# EAGLE design iCEBlaster (EAGLE 9.6.2)
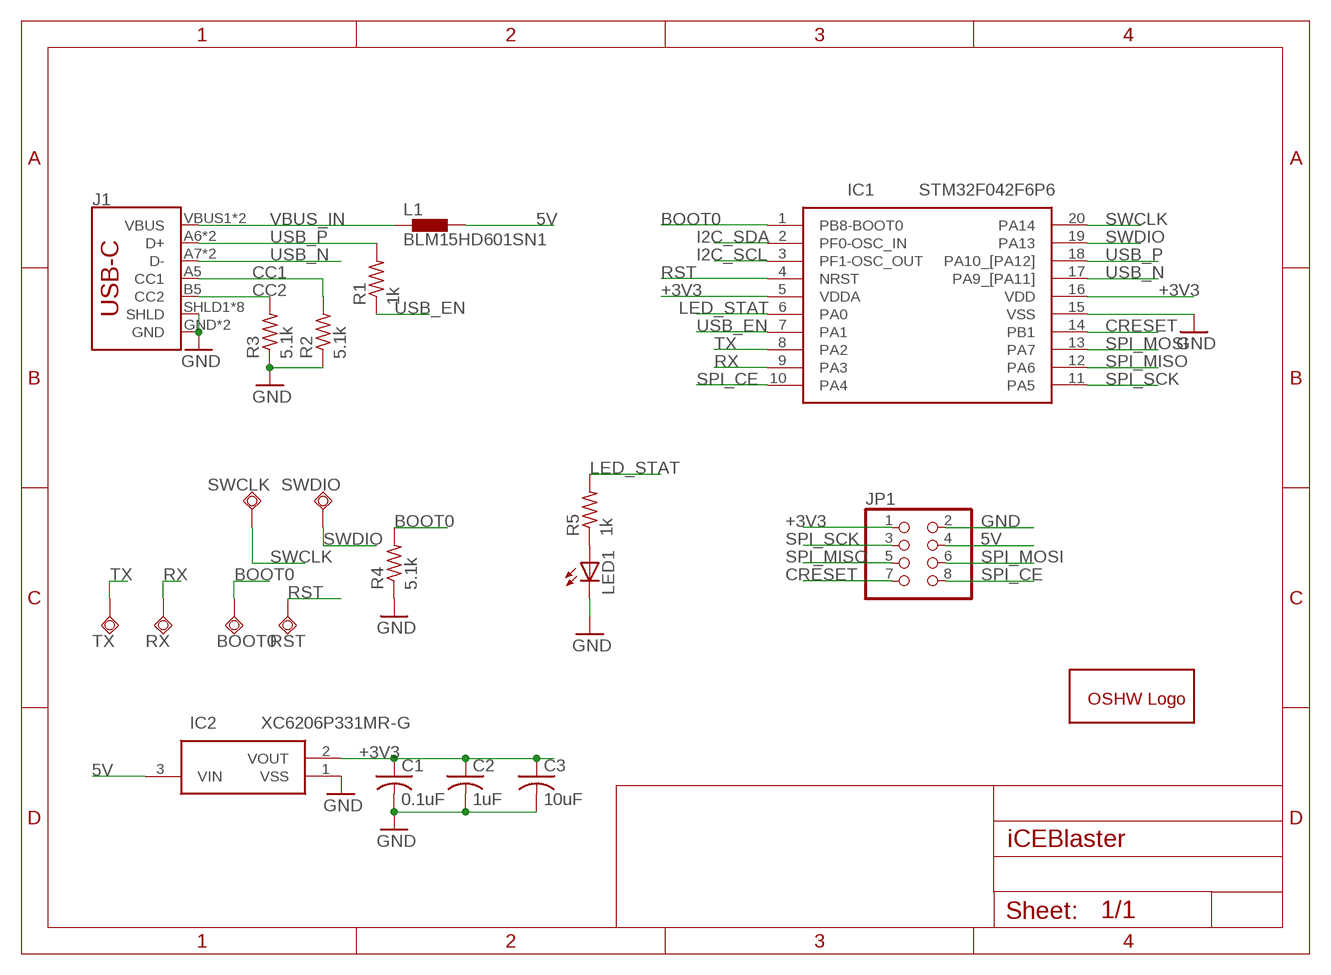
[diagram p0: schematic, sheet 1]

## Parts
BOOT0  TPSQTP15SQ  [TP15SQ]
C1  0.1uF  C-USC0603  [C0603]
C2  1uF  C-USC0603  [C0603]
C3  10uF  C-USC0603  [C0603]
GOLD_ORB_SM1  OSHWLOGOLOGO5MM  [OSHW_5MM]
IC1  STM32F042F6P6  [SOP65P640X120-20N]
IC2  XC6206P331MR-G  [SOT95P280X130-3N]
J1  SPARKFUN-CONNECTORS_USB_C16PIN  [SPARKFUN-CONNECTORS_USB-C-16P]
JP1  PINHD-2X4/90  [2X04/90]
L1  BLM15HD601SN1  [0402]
LED1  LEDCHIP-LED0603  [CHIP-LED0603]
R1  1k  R-US_R0603  [R0603]
R2  5.1k  R-US_R0603  [R0603]
R3  5.1k  R-US_R0603  [R0603]
R4  5.1k  R-US_R0603  [R0603]
R5  1k  R-US_R0603  [R0603]
RST  TPSQTP15SQ  [TP15SQ]
RX  TPSQTP15SQ  [TP15SQ]
SWCLK  TPSQTP15SQ  [TP15SQ]
SWDIO  TPSQTP15SQ  [TP15SQ]
TX  TPSQTP15SQ  [TP15SQ]

## Nets
5V: IC2.3(VIN) JP1.4 L1.2
+3V3: C1.1 C2.1 C3.1 IC1.5(VDDA) IC1.16(VDD) IC2.2(VOUT) JP1.1
BOOT0: BOOT0.TP IC1.1(PB8-BOOT0) R4.2
CC1: J1.A5(CC1) R2.2
CC2: J1.B5(CC2) R3.2
CRESET: IC1.14(PB1) JP1.7
GND: C1.2 C2.2 C3.2 IC1.15(VSS) IC2.1(VSS) J1.GND J1.GND2(GND) J1.SHLD1(SHLD) J1.SHLD2(SHLD) J1.SHLD3(SHLD) J1.SHLD4(SHLD) J1.SHLD5(SHLD) J1.SHLD6(SHLD) J1.SHLD7(SHLD) J1.SHLD8(SHLD) JP1.2 LED1.C R2.1 R3.1 R4.1
I2C_SCL: IC1.3(PF1-OSC_OUT)
I2C_SDA: IC1.2(PF0-OSC_IN)
LED_STAT: IC1.6(PA0) R5.2
N$1: LED1.A R5.1
RST: IC1.4(NRST) RST.TP
RX: IC1.9(PA3) RX.TP
SPI_CE: IC1.10(PA4) JP1.8
SPI_MISO: IC1.12(PA6) JP1.5
SPI_MOSI: IC1.13(PA7) JP1.6
SPI_SCK: IC1.11(PA5) JP1.3
SWCLK: IC1.20(PA14) SWCLK.TP
SWDIO: IC1.19(PA13) SWDIO.TP
TX: IC1.8(PA2) TX.TP
USB_EN: IC1.7(PA1) R1.1
USB_N: IC1.17(PA9_[PA11]) J1.A7(D-) J1.B7(D-)
USB_P: IC1.18(PA10_[PA12]) J1.A6(D+) J1.B6(D+) R1.2
VBUS_IN: J1.VBUS1(VBUS) J1.VBUS2(VBUS) L1.1

## Library data of the parts
BOOT0 RST RX SWCLK SWDIO TX = testpad:TPSQ: Test pad
C1-C3 = adafruit:C-US: CAPACITOR, American symbol
GOLD_ORB_SM1 = oshw:OSHWLOGO: The OSHW logo for PCB layout
IC1 = STM32F042F6P6:STM32F042F6P6: 32-Bit MCU 32K Flash USB2.0 CAN TSSOP20 STMicroelectronics STM32F042F6P6, 32bit ARM Cortex M0 Microcontroller, 48MHz, 32 kB Flash, 20-Pin TSSOP Source: Datasheet <http://www.st.com/content/ccc/resource/technical/document/datasheet/52/ad/d0/80/e6/be/40/ad/DM00105814.pdf/files/DM00105814.pdf/jcr:content/translations/en.DM00105814.pdf>; ARROW_PART_NUMBER: STM32F042F6P6; ARROW_PRICE-STOCK: https://www.arrow.com/en/products/stm32f042f6p6/stmicroelectronics; DESCRIPTION: 32-Bit MCU 32K Flash USB2.0 CAN TSSOP20 STMicroelectronics STM32F042F6P6, 32bit ARM Cortex M0 Microcontroller, 48MHz, 32 kB Flash, 20-Pin TSSOP; HEIGHT: 1.2mm; MANUFACTURER_NAME: STMicroelectronics; MANUFACTURER_PART_NUMBER: STM32F042F6P6; MOUSER_PART_NUMBER: 511-STM32F042F6P6; MOUSER_PRICE-STOCK: https://www.mouser.co.uk/ProductDetail/STMicroelectronics/STM32F042F6P6?qs=4b8myOmUP%252BsTtpJfUMo83g%3D%3D
IC2 = XC6206P331MR-G:XC6206P331MR-G: LDO Voltage Regulators Source: Datasheet <https://www.torexsemi.com/file/xc6206/XC6206.pdf>; DESCRIPTION: LDO Voltage Regulators; HEIGHT: 1.3mm; MANUFACTURER_NAME: Torex; MANUFACTURER_PART_NUMBER: XC6206P331MR-G; MOUSER_PART_NUMBER: 865-XC6206P331MR-G; MOUSER_PRICE-STOCK: https://www.mouser.co.uk/ProductDetail/Torex-Semiconductor/XC6206P331MR-G?qs=AsjdqWjXhJ%252B7jjWBpr1yow%3D%3D
J1 = USB-C-Breakout:SPARKFUN-CONNECTORS_USB_C: USB Type C 16Pin Connector Super Speed pins not available on the 16-pin purely SMD connector so this part is best for USB 2.0 implementations. D1 and D2 are tied together enabling D+/- no matter which way the cable is plugged into the connector. The two channel configuration pins (CC1/2) are exposed. These are normally connected to ground via 5.1k resistors but can be reconfigured for high current/high power applications.; PROD_ID: CONN-14122
JP1 = pinhead:PINHD-2X4: PIN HEADER
L1 = inductors:BLM15H: EMIFIL (R) Chip Ferrite Bead for GHz Noise Source: http://www.murata.com/ Ferrite Bead BLM15H.pdf
LED1 = adafruit:LED: LED OSRAM: - CHIPLED LG R971, LG N971, LY N971, LG Q971, LY Q971, LO R971, LY R971 LH N974, LH R974 LS Q976, LO Q976, LY Q976 LO Q996 - Hyper CHIPLED LW Q18S LB Q993, LB Q99A, LB R99A - SideLED LS A670, LO A670, LY A670, LG A670, LP A670 LB A673, LV A673, LT A673, LW A673 LH A674 LY A675 LS A676, LA A676, LO A676, LY A676, LW A676 LS A679, LY A679, LG A679 - Hyper Micro SIDELED® LS Y876, LA Y876, LO Y876, LY Y876 LT Y87S - SmartLED LW L88C, LW L88S LB L89C, LB L89S, LG L890 LS L89K, LO L89K, LY L89K LS L896, LA L896, LO L896, LY L896 - TOPLED LS T670, LO T670, LY T670, LG T670, LP T670 LSG T670, LSP T670, LSY T670, LOP T670, LYG T670 LG T671, LOG T671, LSG T671 LB T673, LV T673, LT T673, LW T673 LH T674 LS T676, LA T676, LO T676, LY T676, LB T676, LH T676, LSB T676, LW T676 LB T67C, LV T67C, LT T67C, LS T67K, LO T67K, LY T67K, LW E67C LS E67B, LA E67B, LO E67B, LY E67B, LB E67C, LV E67C, LT E67C LW T67C LS T679, LY T679, LG T679 LS T770, LO T770, LY T770, LG T770, LP T770 LB T773, LV T773, LT T773, LW T773 LH T774 LS E675, LA E675, LY E675, LS T675 LS T776, LA T776, LO T776, LY T776, LB T776 LHGB T686 LT T68C, LB T68C - Hyper Mini TOPLED® LB M676 - Mini TOPLED Santana® LG M470 LS M47K, LO M47K, LY M47K Source: http://www.osram.convergy.de/
R1-R5 = adafruit:R-US_: RESISTOR, American symbol

## Board
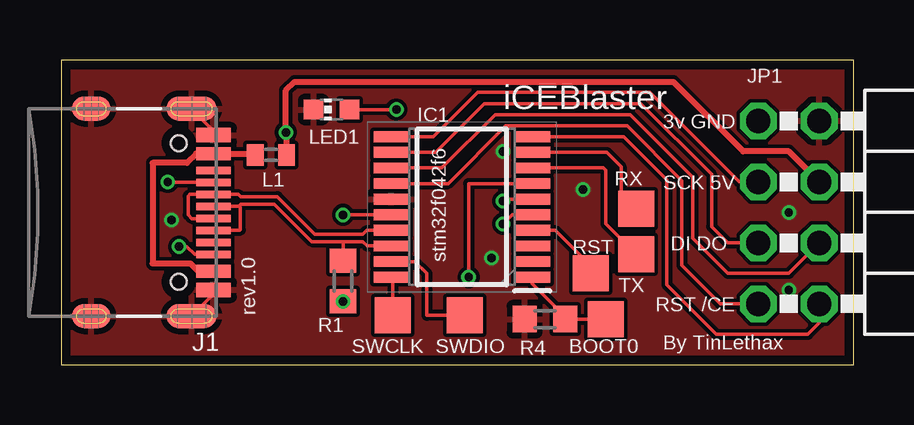
[diagram p1: board, top side]
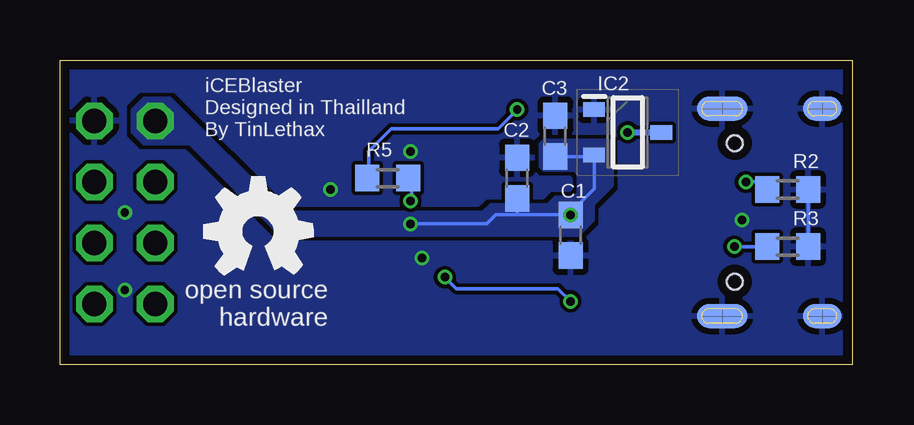
[diagram p2: board, bottom side, seen from below]

Size 33.02 x 12.7 mm. Coordinates in mm from the lower left corner, seen from the top.
Outline: 0,0 33.02,0 33.02,12.7 0,12.7 0,0
Copper layers (1*16): Top 0.035559375mm / dielectric 1.6mm / Bottom 0.035559375mm
Design rules "oshpark-2layer": minimum track width 6mil, minimum drill 10mil, track to track 6mil, track to pad 6mil, pad to pad 6mil, via to via 6mil, smd to smd 6mil, copper to edge 15mil, drill to drill 6mil, minimum pad ring 5mil, minimum via ring 5mil, stop-mask expansion 2.5mil, vias tented up to drill 0mil, thermal gap 10mil

### Footprints (pad centres in the part's own frame; a part is rotated, then mirrored left to right if it is on the bottom)
TP15SQ = smd 1.5 x 1.5: TP 0,0
C0603 = smd 1.1 x 1: 1 -0.85,0; 2 0.85,0
SOP65P640X120-20N = smd 1.475 x 0.45: 1 -2.938,2.925; 2 -2.938,2.275; 3 -2.938,1.625; 4 -2.938,0.975; 5 -2.938,0.325; 6 -2.938,-0.325; 7 -2.938,-0.975; 8 -2.938,-1.625; 9 -2.938,-2.275; 10 -2.938,-2.925; 11 2.938,-2.925; 12 2.938,-2.275; 13 2.938,-1.625; 14 2.938,-0.975; 15 2.938,-0.325; 16 2.938,0.325; 17 2.938,0.975; 18 2.938,1.625; 19 2.938,2.275; 20 2.938,2.925
SOT95P280X130-3N = smd 0.9 x 0.6: 1 -1.4,0.95; 2 -1.4,-0.95; 3 1.4,0
SPARKFUN-CONNECTORS_USB-C-16P = smd 0.3 x 1.45: A5 -1.25,0; A6 -0.25,0; A7 0.25,0; A8 1.25,0; B5 1.75,0; B6 0.75,0; B7 -0.75,0; B8 -1.75,0 | smd 0.6 x 1.45: GND -3.225,0; GND2 3.225,0 | smd 1 x 2.1: SHLD1 -4.32,-0.915; SHLD2 4.32,-0.915 | smd 1 x 2.1 bottom: SHLD3 -4.32,-0.915; SHLD4 4.32,-0.915 | smd 1 x 1.6: SHLD5 -4.32,-5.095; SHLD8 4.32,-5.095 | smd 1 x 1.6 bottom: SHLD6 -4.32,-5.095; SHLD7 4.32,-5.095 | smd 0.55 x 1.45: VBUS1 -2.45,0; VBUS2 2.45,0 | hole 0.65: -2.89,-1.445; 2.89,-1.445
2X04/90 = drill 1.016 octagon: 1 -3.81,-6.35; 2 -3.81,-3.81; 3 -1.27,-6.35; 4 -1.27,-3.81; 5 1.27,-6.35; 6 1.27,-3.81; 7 3.81,-6.35; 8 3.81,-3.81
0402 = smd 0.7 x 0.9: 1 -0.65,0; 2 0.65,0
CHIP-LED0603 = smd 0.8 x 0.8: A 0,-0.75; C 0,0.75
R0603 = smd 1 x 1.1: 1 -0.85,0; 2 0.85,0

### Placement (x,y rotation side)
BOOT0  22.7,1.91 0 top
C1  11.75,5.4 270 bottom
C2  13.97,7.78 90 bottom
C3  12.38,9.53 90 bottom
GOLD_ORB_SM1  24.77,5.56 0 bottom
IC1  16.7,6.58 180 top
IC2  9.37,9.68 0 bottom
J1  6.35,6.35 270 top
JP1  35.4,6.35 270 top
L1  8.74,8.75 0 top
LED1  11.27,10.64 90 top
R1  11.75,3.49 90 top
R2  2.7,7.3 180 bottom
R3  2.7,4.92 180 bottom
R4  20.16,1.91 0 top
R5  19.37,7.78 0 bottom
RST  22.07,3.81 0 top
RX  23.97,6.51 0 top
SWCLK  13.81,2.06 0 top
SWDIO  16.83,2.06 0 top
TX  23.97,4.6 0 top

### Tracks (layer width: path | path; a pad name or v marks a point on that pad's centre or on a via)
5V  (via drill 0.35)
  Top 0.254: L1.2 9.39,9.66 v9.37,9.68 9.37,11.43 9.73,11.79 25.51,11.79 28.42,8.89 30.32,8.89 JP1.4
  Bottom 0.254: v9.37,9.68 IC2.3
+3V3  (via drill 0.35)
  Top 0.152: IC1.16 11.84,6.25 11.75,6.35 C1.1 | v18.41,5.87 18.8,6.25 IC1.5
  Bottom 0.152: 13.97,6.25 C1.1 11.75,6.35 10.77,7.33 IC2.2 10.82,8.68 C3.1 | 13.97,6.25 14.87,6.25 15.24,5.87 v18.41,5.87 | C2.1 13.97,6.25
  other vias: 11.75,6.25
  pour Bottom (no thermals): 10,9.21 10.16,9.37 12.86,9.37 13.02,9.21 13.02,8.26 12.86,8.1 11.59,8.1 11.43,7.94 11.43,7.14 11.59,6.98 12.38,6.98 12.7,6.67 15.08,6.67 15.4,6.35 23.65,6.35 28.42,11.11 29.53,11.11 30,10.64 30,9.68 29.53,9.21 27.62,9.21 23.81,5.4 11.43,5.4 10.79,6.03 10.79,6.67 10,7.46
BOOT0
  Top 0.152: IC1.1 19.64,3.38 21.01,2.01 R4.2 BOOT0.TP
CC1  (via drill 0.35)
  Top 0.152: J1.A5 4.46,7.6 v4.45,7.62
  Bottom 0.152: v4.45,7.62 3.87,7.62 R2.2
CC2  (via drill 0.35)
  Top 0.152: J1.B5 5.56,4.6 5.24,4.92 v4.92,4.92
  Bottom 0.152: v4.92,4.92 R3.2
CRESET
  Top 0.152: IC1.14 16.13,7.55 18.53,9.96 23.59,9.96 25.86,7.68 25.86,4.14 27.46,2.54 JP1.7
GND  (via drill 0.35)
  Top 0.152: J1.SHLD6 J1.SHLD3 6.35,9.75 J1.GND | J1.SHLD8 J1.SHLD4 6.35,2.95 J1.GND2
  Bottom 0.152: R2.1 R3.1
  other vias: 4.6,6.03 17.94,4.45 30.32,6.35 30.32,3.12 21.75,7.3 18.41,8.89
  pour Top (rank 2): 0,12.7 33.02,12.7 33.02,0 0,0
  pour Bottom (rank 2): 0,12.7 33.02,12.7 33.02,0 0,0
LED_STAT  (via drill 0.35)
  Top 0.152: IC1.6 18.49,6.9 v18.41,6.83
  Bottom 0.152: v18.41,6.83 18.36,6.88 18.36,7.62 R5.2
N$1  (via drill 0.35)
  Top 0.152: v13.97,10.64 LED1.A
  Bottom 0.152: R5.1 20.16,7.84 20.16,8.89 19.21,9.84 14.76,9.84 v13.97,10.64
RST
  Top 0.152: IC1.4 20.59,5.6 22.07,4.13 RST.TP
RX
  Top 0.152: IC1.9 22.74,8.85 23.34,8.26 23.34,7.14 RX.TP
SPI_CE
  Top 0.152: IC1.10 23.45,9.5 25.24,7.71 25.24,3.33 27.3,1.27 31.11,1.27 31.59,1.75 JP1.8
SPI_MISO
  Top 0.152: IC1.12 15.61,8.85 17.64,10.88 24.16,10.88 27.11,7.93 27.11,5.75 27.78,5.08 JP1.5
SPI_MOSI
  Top 0.152: IC1.13 15.87,8.2 18.09,10.42 23.71,10.42 26.33,7.8 26.33,5.26 27.78,3.81 30.32,3.81 JP1.6
SPI_SCK
  Top 0.152: IC1.11 15.51,9.5 17.36,11.35 24.53,11.35 28.26,7.62 JP1.3
SWCLK
  Top 0.152: IC1.20 13.81,3.6 SWCLK.TP
SWDIO
  Top 0.152: IC1.19 14.75,4.3 15.24,3.81 15.24,2.06 SWDIO.TP
TX
  Top 0.152: IC1.8 22.59,8.2 22.7,8.1 22.7,5.87 TX.TP
USB_EN  (via drill 0.35)
  Top 0.152: IC1.7 16.99,7.55 v16.99,3.65
  Bottom 0.152: v16.99,3.65 16.51,3.17 12.28,3.17 R1.1
  other vias: 11.75,2.64
USB_N
  Top 0.152: J1.A7 5.45,6.09 5.29,6.25 5.29,7.03 5.36,7.1 J1.B7 7.38,7.1 7.48,7 9.01,7 10.58,5.44 12.57,5.44 12.74,5.6 IC1.17
USB_P
  Top 0.152: J1.B6 7.44,5.6 7.47,5.63 7.47,6.56 7.43,6.6 J1.A6 7.38,6.6 7.48,6.7 8.88,6.7 10.45,5.13 11.75,5.13 | 11.75,5.13 12.57,5.13 12.75,4.95 IC1.18 | R1.2 11.75,5.13
VBUS_IN
  Top 0.254: J1.VBUS2 5.71,3.9 5.4,4.22 3.81,4.22 3.81,8.41 5.24,8.41 5.62,8.8 J1.VBUS1 8.04,8.8 L1.1

### Text on the board
tNames: iCEBlaster | 3v GND | SCK 5V | stm32f042f6 | DI DO | rev1.0 | RST /CE | By TinLethax
bNames: iCEBlaster / Designed in Thailland / By TinLethax